# EAGLE board Primary (EAGLE 5.12)
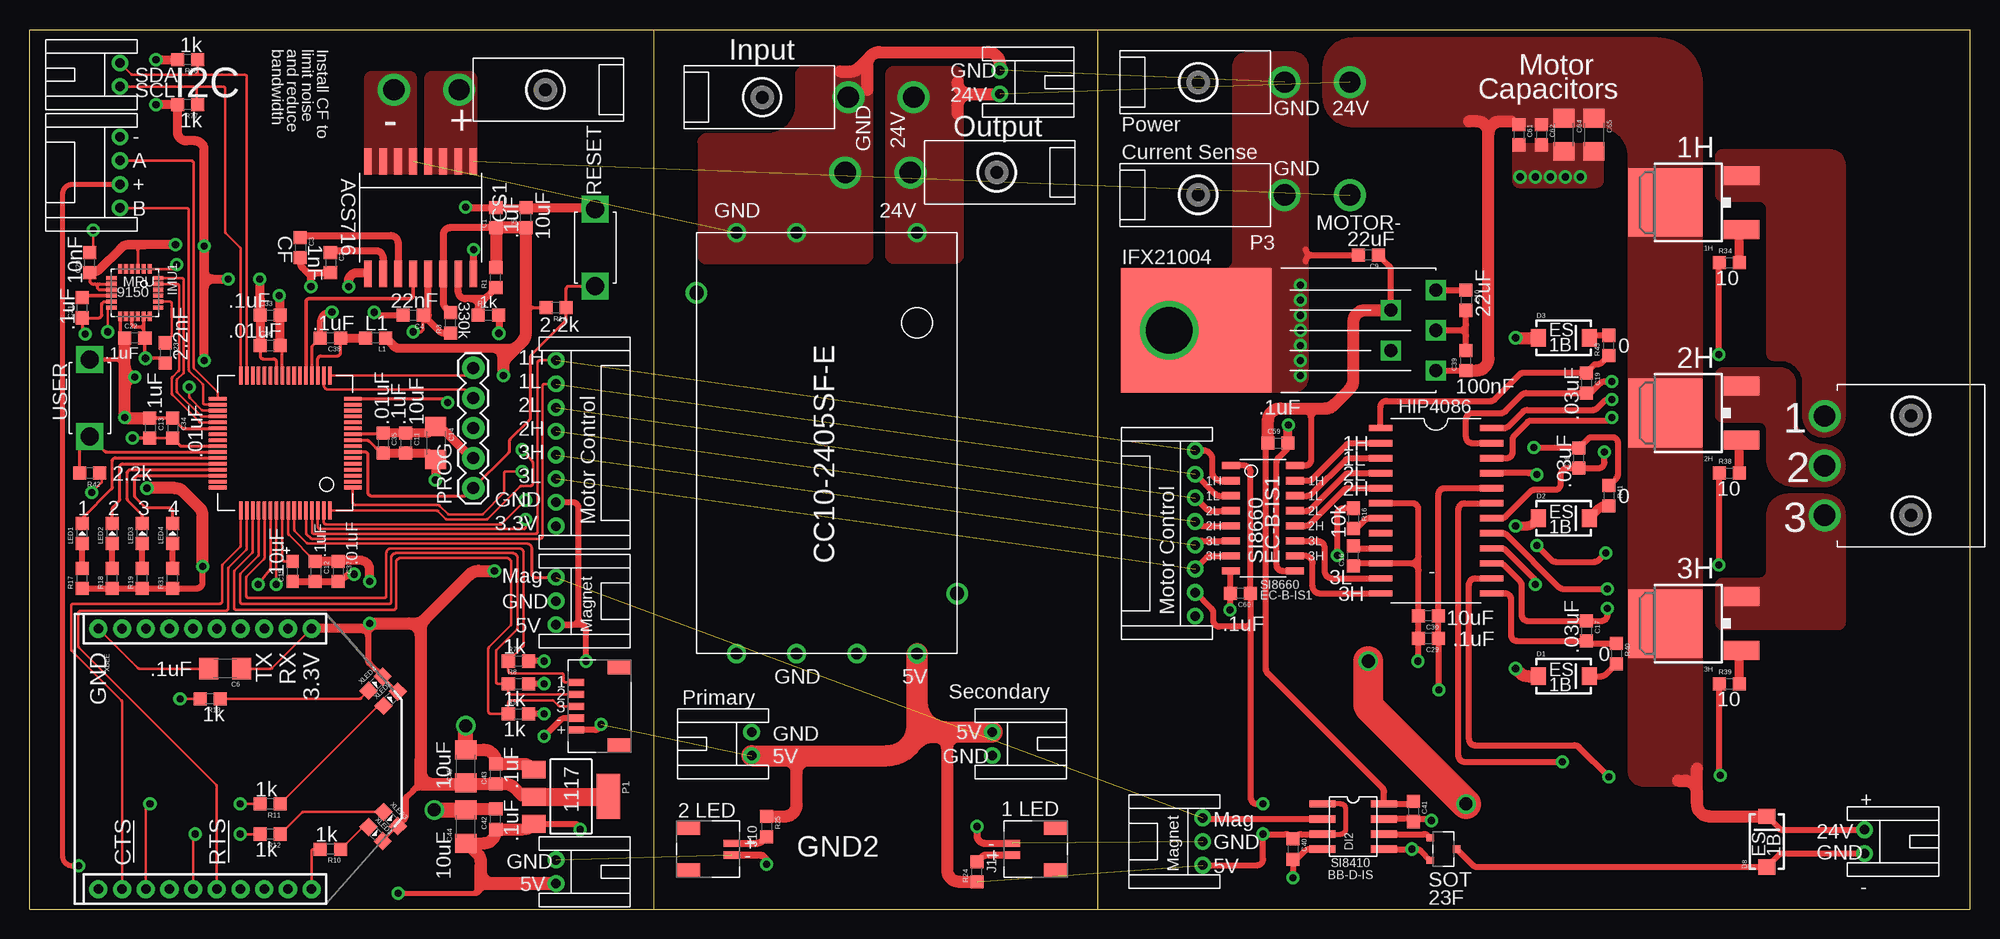
[diagram p4: board, top side]
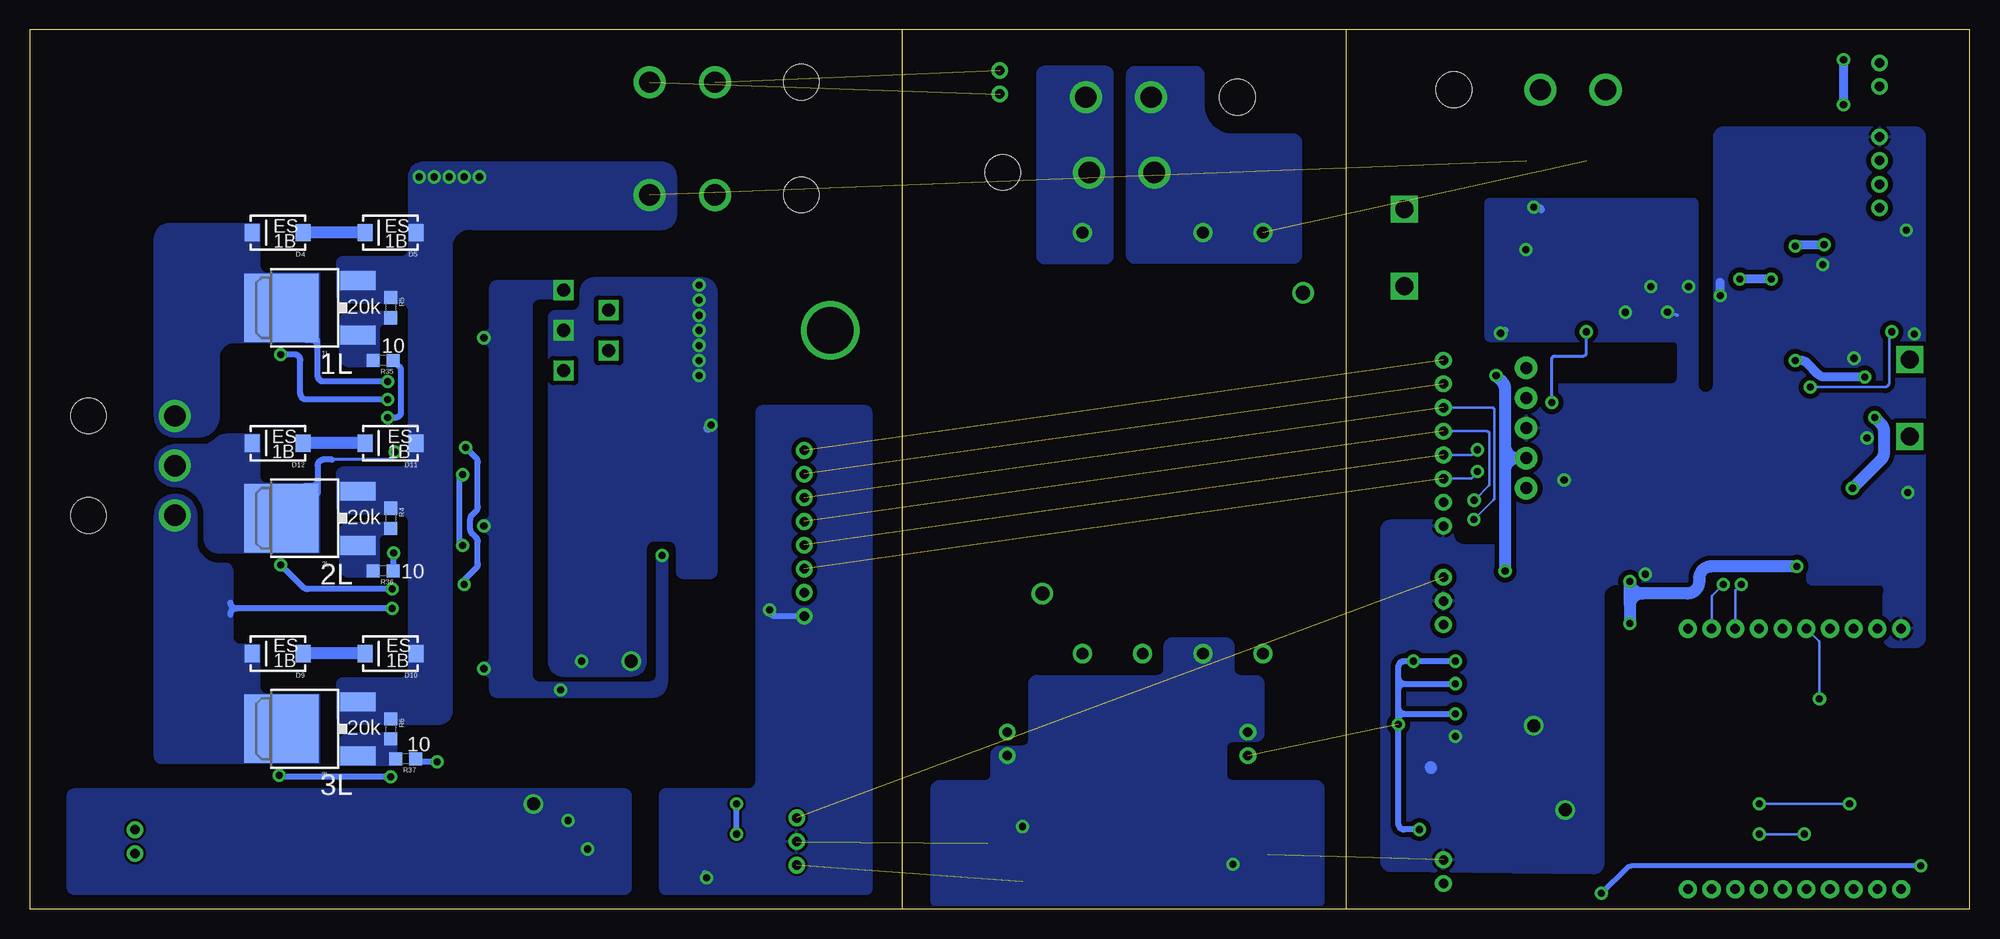
[diagram p5: board, bottom side, seen from below]

Size 163.83 x 74.3 mm. Coordinates in mm from the lower left corner, seen from the top.
Outline: 90.17,0 0,0 0,74.3 52.7,74.3
Outline: 90.17,0 163.83,0 163.83,74.3 90.17,74.3
Outline: 52.7,74.3 90.17,74.3
Outline: 90.17,74.3 90.17,0
Outline: 52.7,74.3 52.7,0
Copper layers (1*4*8*16): Top 0.035mm / dielectric 0.15mm / M-Top 0.035mm / dielectric 0.15mm / M-Bottom 0.035mm / dielectric 0.15mm / Bottom 0.035mm
Design rules "Andrew *": minimum track width 8mil, minimum drill 20mil, track to track 8mil, track to pad 8mil, pad to pad 2mil, via to via 8mil, smd to smd 8mil, copper to edge 10mil, drill to drill 8mil, minimum pad ring 12mil, minimum via ring 10mil, stop-mask expansion 4mil, vias tented up to drill 25mil, thermal gap 10mil

## Footprints (pad centres in the part's own frame; a part is rotated, then mirrored left to right if it is on the bottom)
DPAK = smd 5.791 x 6.274: D 0,1.587 | smd 1.6 x 3: G -2.286,-4.851; S 2.286,-4.851
0603 = smd 1.1 x 1.1: 1 -0.85,0; 2 0.85,0
1206 = smd 1.6 x 1.8: 1 -1.4,0; 2 1.4,0
0603-POL = smd 1.1 x 1: + 0.85,0; - -0.85,0
SOIC16-W = smd 0.65 x 2.25: 1 -4.445,-4.75; 2 -3.175,-4.75; 3 -1.905,-4.75; 4 -0.635,-4.75; 5 0.635,-4.75; 6 1.905,-4.75; 7 3.175,-4.75; 8 4.445,-4.75; 9 4.445,4.75; 10 3.175,4.75; 11 1.905,4.75; 12 0.635,4.75; 13 -0.635,4.75; 14 -1.905,4.75; 15 -3.175,4.75; 16 -4.445,4.75
SMA-DIODE@1 = smd 1.27 x 1.47: A -2.15,0; C 2.15,0
SOIC16-N = smd 0.6 x 1.55: 1 -4.445,-2.7; 2 -3.175,-2.7; 3 -1.905,-2.7; 4 -0.635,-2.7; 5 0.635,-2.7; 6 1.905,-2.7; 7 3.175,-2.7; 8 4.445,-2.7; 9 4.445,2.7; 10 3.175,2.7; 11 1.905,2.7; 12 0.635,2.7; 13 -0.635,2.7; 14 -1.905,2.7; 15 -3.175,2.7; 16 -4.445,2.7
SOIC8-N = smd 2.2 x 0.6: 1 -2.6,1.905; 2 -2.6,0.635; 3 -2.6,-0.635; 4 -2.6,-1.905; 5 2.6,-1.905; 6 2.6,-0.635; 7 2.6,0.635; 8 2.6,1.905
LGA24_4X4 = smd 0.8 x 0.35: 1 -2,1.25; 2 -2,0.75; 3 -2,0.25; 4 -2,-0.25; 5 -2,-0.75; 6 -2,-1.25; 13 2,-1.25; 14 2,-0.75; 15 2,-0.25; 16 2,0.25; 17 2,0.75; 18 2,1.25 | smd 0.35 x 0.85: 7 -1.25,-1.975; 8 -0.75,-1.975; 9 -0.25,-1.975; 10 0.25,-1.975; 11 0.75,-1.975; 12 1.25,-1.975; 19 1.25,1.975; 20 0.75,1.975; 21 0.25,1.975; 22 -0.25,1.975; 23 -0.75,1.975; 24 -1.25,1.975
JST-2-PH-TH = drill 0.8 round: 1 -1,-6.35; 2 1,-6.35
JST-4-PH-TH = drill 0.8 round: 1 -3,-6.35; 2 -1,-6.35; 3 1,-6.35; 4 3,-6.35
JST-8-PH-TH = drill 0.8 round: 1 -7,-6.35; 2 -5,-6.35; 3 -3,-6.35; 4 -1,-6.35; 5 1,-6.35; 6 3,-6.35; 7 5,-6.35; 8 7,-6.35
JST-3-PH-TH = drill 0.8 round: 1 -2,-6.35; 2 0,-6.35; 3 2,-6.35
JST-SH-5 = smd 0.6 x 1.35: 1 2,4.675; 2 1,4.675; 3 0,4.675; 4 -1,4.675; 5 -2,4.675 | smd 1.2 x 2: P$6 -3.3,1; P$7 3.3,1
JST-SH-2 = smd 0.6 x 1.35: 1 0.5,4.675; 2 -0.5,4.675 | smd 1.2 x 2: P$6 -1.8,1; P$7 1.8,1
MOLEX-2-MINIFITJR-RA = drill 1.803 round: 1 0,13.894; 2 0,19.406 | hole 3: 0,6.604
MOLEX-3-MINIFITJR-RA = drill 1.803 round: 1 4.191,13.538; 2 0,13.538; 3 -4.191,13.538 | hole 3: -4.204,6.248; 4.204,6.248
0603-DIODE = smd 1.1 x 1.1: AN -0.85,0; CAT 0.85,0
SOT23F = smd 0.6 x 0.65: D 0,1.125; G -0.95,-1.125; S 0.95,-1.125
SOIC24-W = smd 0.533 x 1.981: 1 -6.985,-4.686; 2 -5.715,-4.686; 3 -4.445,-4.686; 4 -3.175,-4.686; 5 -1.905,-4.686; 6 -0.635,-4.686; 7 0.635,-4.686; 8 1.905,-4.686; 9 3.175,-4.686; 10 4.445,-4.686; 11 5.715,-4.686; 12 6.985,-4.686; 13 6.985,4.686; 14 5.715,4.686; 15 4.445,4.686; 16 3.175,4.686; 17 1.905,4.686; 18 0.635,4.686; 19 -0.635,4.686; 20 -1.905,4.686; 21 -3.175,4.686; 22 -4.445,4.686; 23 -5.715,4.686; 24 -6.985,4.686
SOT223 = smd 1.499 x 2.007: 1 -2.261,-3.15; 2 0.025,-3.15; 3 2.311,-3.15 | smd 3.81 x 2.007: 4 0,3.15
CC10-2405SF-E = drill 1 round: 1 -17.78,7.62; 2 -17.78,-2.54; 3 -17.78,-7.62; 4 17.78,-7.62; 5 17.78,-2.54; 6 17.78,2.54; 7 17.78,7.62 | drill 1.2 round: P$1 12.7,11; P$2 -12.7,-11
TO220-5 = drill 1.1 square: 1 3.81,-3.404; 2 0,-1.702; 3 3.81,0; 4 0,1.702; 5 3.81,3.404 | smd 12.7 x 10.541: PAD -16.434,0 | drill 3.937 round: PAD2 -18.72,0
TQFP64_10X10 = smd 1.5 x 0.3: 1 -5.7,3.75; 2 -5.7,3.25; 3 -5.7,2.75; 4 -5.7,2.25; 5 -5.7,1.75; 6 -5.7,1.25; 7 -5.7,0.75; 8 -5.7,0.25; 9 -5.7,-0.25; 10 -5.7,-0.75; 11 -5.7,-1.25; 12 -5.7,-1.75; 13 -5.7,-2.25; 14 -5.7,-2.75; 15 -5.7,-3.25; 16 -5.7,-3.75; 33 5.7,-3.75; 34 5.7,-3.25; 35 5.7,-2.75; 36 5.7,-2.25; 37 5.7,-1.75; 38 5.7,-1.25; 39 5.7,-0.75; 40 5.7,-0.25; 41 5.7,0.25; 42 5.7,0.75; 43 5.7,1.25; 44 5.7,1.75; 45 5.7,2.25; 46 5.7,2.75; 47 5.7,3.25; 48 5.7,3.75 | smd 0.3 x 1.5: 17 -3.75,-5.7; 18 -3.25,-5.7; 19 -2.75,-5.7; 20 -2.25,-5.7; 21 -1.75,-5.7; 22 -1.25,-5.7; 23 -0.75,-5.7; 24 -0.25,-5.7; 25 0.25,-5.7; 26 0.75,-5.7; 27 1.25,-5.7; 28 1.75,-5.7; 29 2.25,-5.7; 30 2.75,-5.7; 31 3.25,-5.7; 32 3.75,-5.7; 49 3.75,5.7; 50 3.25,5.7; 51 2.75,5.7; 52 2.25,5.7; 53 1.75,5.7; 54 1.25,5.7; 55 0.75,5.7; 56 0.25,5.7; 57 -0.25,5.7; 58 -0.75,5.7; 59 -1.25,5.7; 60 -1.75,5.7; 61 -2.25,5.7; 62 -2.75,5.7; 63 -3.25,5.7; 64 -3.75,5.7
1X05 = drill 1.016 pad 1.88 round: 1 0,0; 2 2.54,0; 3 5.08,0; 4 7.62,0; 5 10.16,0
TACTILE_SWITCH = drill 1.5 square: 1 -3.25,0; 2 3.25,0
XBEE-SILK = drill 0.8 pad 1.524 round: 1 -11,20; 2 -11,18; 3 -11,16; 4 -11,14; 5 -11,12; 6 -11,10; 7 -11,8; 8 -11,6; 9 -11,4; 10 -11,2; 11 11,2; 12 11,4; 13 11,6; 14 11,8; 15 11,10; 16 11,12; 17 11,14; 18 11,16; 19 11,18; 20 11,20

## Placement (x,y rotation side)
1H  IRLR024  [DPAK]  139.7,59.69 90 top
1L  IRLR024  [DPAK]  140.97,50.8 90 bottom
2H  IRLR024  [DPAK]  139.7,41.91 90 top
2L  IRLR024  [DPAK]  140.97,33.02 90 bottom
3H  IRLR024  [DPAK]  139.7,24.13 90 top
3L  IRLR024  [DPAK]  140.97,15.24 90 bottom
C1  .1uF  [0603]  39.37,58.42 90 top
C2  1nF  [0603]  25.4,54.61 270 top
C3  7nF  [0603]  22.86,55.88 270 top
C4  22nF  [0603]  32.38,50.16 180 top
C5  10uF  [0603]  41.91,58.42 90 top
C6  .1uF  [1206]  16.51,20.32 180 top
C9  22uF  [0603]  113.03,55.24 180 top
C10  22uF 15V  [0603]  121.28,51.44 270 top
C11  .1uF  [0603]  31.75,39.37 270 top
C12  .1uF  [0603]  24.13,28.52 270 top
C13  .1uF  [0603]  10.16,40.64 270 top
C14  10uF  [1206]  34.29,39.37 270 top
C15  10uF  [0603-POL]  22.23,28.52 90 top
C16  DNI  [0603]  111.76,29.84 90 top
C17  .03uF 15V  [0603]  131.44,23.5 270 top
C18  .03uF 15V  [0603]  130.81,38.1 90 top
C19  .03uF 15V  [0603]  131.44,44.45 270 top
C20  10nF  [0603]  5.08,54.61 90 top
C21  .1uF  [0603]  4.45,50.8 90 top
C22  .1uF  [0603]  8.89,48.26 0 top
C23  2.2nF  [0603]  11.43,46.99 270 top
C29  .1uF  [0603]  118.11,22.86 180 top
C30  10uF  [0603]  118.11,24.77 180 top
C33  .1uF  [0603]  20.32,50.16 0 top
C34  .01uF  [0603]  12.06,40.64 270 top
C35  .01uF  [0603]  29.84,39.37 270 top
C36  .01uF  [0603]  20.32,47.62 0 top
C37  .01uF  [0603]  26.04,28.52 270 top
C38  .1uF  [0603]  25.4,48.26 180 top
C39  .1uF 48V  [0603]  121.28,46.35 90 top
C40  .1uF  [0603]  106.68,5.08 270 top
C41  .1uF  [0603]  116.84,8.26 270 top
C42  .1uF  [0603]  39.37,7.62 90 top
C43  .1uF  [0603]  39.37,11.43 90 top
C44  10uF  [1206]  36.83,6.99 90 top
C45  10uF  [1206]  36.83,12.06 90 top
C59  .1uF  [0603]  105.41,39.37 0 top
C60  .1uF  [0603]  102.23,26.67 180 top
C61  .01uF  [0603]  125.73,65.41 270 top
C62  .1uF  [0603]  127.64,65.41 270 top
C64  1uF  [1206]  129.54,65.41 270 top
C65  10uF  [1206]  132.08,65.41 270 top
CS1  ACS716KLATR-6BB-T  [SOIC16-W]  33.02,58.42 180 top
D1  ES1B  [SMA-DIODE@1]  129.54,19.68 0 top
D2  ES1B  [SMA-DIODE@1]  129.54,33.02 0 top
D3  ES1B  [SMA-DIODE@1]  129.54,48.26 0 top
D4  ES1B  [SMA-DIODE@1]  142.88,57.15 180 bottom
D5  ES1B  [SMA-DIODE@1]  133.35,57.15 180 bottom
D8  ES1B  [SMA-DIODE@1]  146.69,5.71 90 top
D9  ES1B  [SMA-DIODE@1]  142.88,21.59 180 bottom
D10  ES1B  [SMA-DIODE@1]  133.35,21.59 180 bottom
D11  ES1B  [SMA-DIODE@1]  133.35,39.37 180 bottom
D12  ES1B  [SMA-DIODE@1]  142.88,39.37 180 bottom
DI1  DIGITAL-ISOLATOR-6CH  [SOIC16-N]  104.14,33.02 270 top
DI2  DIGITAL-ISOLATOR-1CHSOIC8-N  [SOIC8-N]  111.76,6.99 0 top
IMU1  MPU-9150  [LGA24_4X4]  8.89,52.07 270 top
J1  [JST-2-PH-TH]  1.27,70.48 90 top
J2  [JST-4-PH-TH]  1.27,62.23 90 top
J3  MO8JST-SH-TH  [JST-8-PH-TH]  50.8,39.37 270 top
J4  [JST-3-PH-TH]  50.8,26.04 270 top
J5  [JST-SH-5]  50.8,17.14 90 top
J6  [JST-2-PH-TH]  50.8,3.17 270 top
J7  [JST-2-PH-TH]  88.27,69.85 270 top
J8  [JST-2-PH-TH]  54.61,13.97 90 top
J9  [JST-2-PH-TH]  87.63,13.97 270 top
J10  [JST-SH-2]  54.61,5.08 270 top
J11  [JST-SH-2]  87.63,5.08 90 top
J12  MO8JST-SH-TH  [JST-8-PH-TH]  92.08,31.75 90 top
J13  [JST-3-PH-TH]  92.71,5.71 90 top
J14  [JST-2-PH-TH]  161.29,5.71 270 top
JP1  [MOLEX-2-MINIFITJR-RA]  50.16,69.22 90 top
JP2  [MOLEX-2-MINIFITJR-RA]  55.24,68.58 270 top
JP3  [MOLEX-2-MINIFITJR-RA]  88.27,62.23 90 top
JP4  [MOLEX-2-MINIFITJR-RA]  92.08,69.85 270 top
JP5  [MOLEX-2-MINIFITJR-RA]  92.08,60.33 270 top
JP6  [MOLEX-3-MINIFITJR-RA]  165.1,37.47 90 top
L1  0ohm  [0603]  29.21,48.26 180 top
LED1  [0603-DIODE]  4.45,31.75 90 top
LED2  [0603-DIODE]  6.99,31.75 90 top
LED3  [0603-DIODE]  9.53,31.75 90 top
LED4  [0603-DIODE]  12.06,31.75 90 top
M1  N-MOSSOT23F  [SOT23F]  119.38,5.08 270 top
MD1  HIP4086  [SOIC24-W]  118.75,33.66 270 top
P1  LINEAR-REGREG1117  [SOT223]  45.72,9.53 270 top
P2  CC10-2405SF-E  [CC10-2405SF-E]  67.31,39.37 270 top
P3  IFX21004TNV51  [TO220-5]  114.94,48.9 0 top
PIC1  DSPIC33EP512MC806  [TQFP64_10X10]  21.59,39.37 180 top
PROG  [1X05]  37.47,35.56 90 top
R1  2k  [0603]  39.37,53.34 90 top
R2  1k  [0603]  38.73,50.16 0 top
R3  330k  [0603]  35.56,49.53 90 top
R4  20k  [0603]  133.35,33.02 270 bottom
R5  20k  [0603]  133.35,50.8 270 bottom
R6  20k  [0603]  133.35,15.24 270 bottom
R7  1k  [0603]  41.27,20.95 0 top
R8  1k  [0603]  41.27,19.05 0 top
R9  1k  [0603]  41.27,16.51 0 top
R10  1k  [0603]  25.4,5.08 180 top
R11  1k  [0603]  20.32,8.89 180 top
R12  1k  [0603]  20.32,6.35 180 top
R13  1k  [0603]  15.24,17.78 180 top
R14  2.2k  [0603]  44.45,50.8 180 top
R16  10k  [0603]  111.76,33.02 270 top
R17  1k  [0603]  4.45,27.94 90 top
R18  1k  [0603]  6.99,27.94 90 top
R19  1k  [0603]  9.53,27.94 90 top
R24  47  [0603]  80.01,3.17 90 top
R25  22  [0603]  62.23,6.99 270 top
R31  1k  [0603]  12.06,27.94 90 top
R34  10ohm  [0603]  143.51,54.61 0 top
R35  10ohm  [0603]  133.99,46.35 180 bottom
R36  10ohm  [0603]  133.99,28.57 180 bottom
R37  10ohm  [0603]  132.08,12.7 180 bottom
R38  10ohm  [0603]  143.51,36.83 0 top
R39  10ohm  [0603]  143.51,19.05 0 top
R40  0ohm  [0603]  133.99,21.59 270 top
R41  0ohm  [0603]  133.35,34.92 270 top
R42  2.2k  [0603]  5.08,36.83 180 top
R43  0ohm  [0603]  133.35,47.62 90 top
R77  1k  [0603]  13.34,67.94 180 top
R78  1k  [0603]  13.34,71.75 180 top
RESET1  TACTILE_SWITCH  [TACTILE_SWITCH]  47.75,55.88 90 top
USER1  TACTILE_SWITCH  [TACTILE_SWITCH]  5.08,43.18 270 top
XBEE  XBEE-1B2  [XBEE-SILK]  3.81,12.7 270 top
XLED1  [0603-DIODE]  29.21,6.35 315 top
XLED2  [0603-DIODE]  30.48,17.78 45 top
XLED3  [0603-DIODE]  30.48,7.62 315 top
XLED4  [0603-DIODE]  29.21,19.05 45 top

## Tracks (layer width: path | path; a pad name or v marks a point on that pad's centre or on a via)
1HO
  Top 0.203: 1H.G 144.36,57.4
  Top 0.762: R34.2 144.36,57.21 1H.G
1HS  (via drill 0.6)
  Top 0.508: v133.6,44.58 132.99,44.58 arc45 132.63,44.43 131.95,43.75 arc-45 131.59,43.6 C19.2 126.36,43.6 arc45 126,43.45 124.61,42.06 arc-45 124.25,41.91 121.79,41.91 arc90 121.28,41.4 121.28,39.88 arc90 121.79,39.37 MD1.23
  Bottom 0.508: v133.6,44.58 139,44.58 arc90 139.51,45.09 139.51,47.56 | 139.51,47.56 arc-90 140.02,48.07 | 140.4,48.07 139.51,48.07 139.51,47.56
  pour Bottom (no thermals): 147.83,41.66 153.29,41.66 153.29,56.64 arc90 152.02,57.91 146.81,57.91 146.56,47.88 arc-90 147.83,46.61
  pour Bottom (no thermals): 151.51,43.43 arc-90 153.29,41.66 arc-90 151.51,39.88 arc-90 149.73,41.66 arc-90
  pour Bottom (no thermals): 139.32,53.72 139.32,47.88 150.75,47.88 150.75,57.91 144.4,57.91 144.4,54.36 arc-90 143.76,53.72
  pour Bottom (no thermals): 147.83,41.66 arc90 149.61,39.88 151.51,39.88 151.51,41.66
  pour Top (no thermals): 151.51,43.43 arc-90 153.29,41.66 arc-90 151.51,39.88 arc-90 149.73,41.66 arc-90
  pour Top (no thermals): 149.73,41.66 153.29,41.66 153.29,62.87 arc90 152.02,64.14 149.73,64.14
  pour Top (no thermals): 142.37,63.5 142.37,60.45 arc90 143,59.82 146.05,59.82 arc-90 146.69,59.18 146.69,46.99 arc90 147.32,46.35 147.83,46.35 arc-90 149.73,44.45 150.11,44.45 150.11,59.82 arc90 150.75,60.45 150.75,64.14 143,64.14 arc90
1LO
  Bottom 0.203: 1L.G 135.47,48.51
  pour Bottom (no thermals): 132.87,50.42 136.8,50.42 arc-90 137.62,49.63 137.62,46.69 arc-90 136.8,45.87 134.37,45.87 134.37,48.97 arc90 133.86,49.48 132.87,49.48
2HO
  Top 0.762: R38.2 144.36,39.43 2H.G
2HS  (via drill 0.6)
  Top 0.508: MD1.18 124.25,33.02 arc45 124.61,33.17 126.72,35.28 arc-45 127.08,35.43 128.78,35.43 arc90 129.29,35.94 129.29,36.74 arc-90 129.79,37.25 C18.1 132.46,37.25 arc90 132.97,37.76 v132.97,38.61
  Bottom 0.254: 132.97,38.48 arc90 133.48,37.97 138.3,37.97
  Bottom 0.508: 139.51,36.26 arc90 140.02,35.75 140.53,35.75 | v132.97,38.61 132.97,38.48 | 138.3,37.97 139,37.97 arc-90 139.51,37.47 139.51,35.12
  pour Top (no thermals): 151.51,39.24 arc-90 153.29,37.47 arc-90 151.51,35.69 arc-90 149.73,37.47 arc-90
  pour Bottom (no thermals): 151.51,39.24 arc-90 153.29,37.47 arc-90 151.51,35.69 arc-90 149.73,37.47 arc-90
  pour Bottom (no thermals): 146.05,40.13 147.09,40.13 arc-45 148.17,39.69 arc45 149.25,39.24 151.51,39.24 151.51,35.69 arc90 149.1,33.27 149.1,31.37 arc-90 147.83,30.1 146.05,30.1
  pour Bottom (no thermals): 139.32,35.94 139.32,30.1 146.56,30.1 146.56,40.13 144.4,40.13 144.4,36.58 arc-90 143.76,35.94
  pour Top (no thermals): 142.37,45.09 142.37,41.78 arc90 143,41.15 146.69,41.15 146.43,45.72 143,45.72 arc90
  pour Top (no thermals): 145.16,45.72 147.83,45.72 arc-90 149.1,44.45 149.1,41.66 arc90 151.51,39.24 151.51,35.69 149.1,35.69 arc-90 146.69,38.1 146.69,40.51 arc90 146.05,41.15 145.16,41.15
2LO
  pour Bottom (no thermals): 132.87,32.64 136.8,32.64 arc-90 137.62,31.85 137.62,28.91 arc-90 136.8,28.09 134.37,28.09 134.37,31.19 arc90 133.86,31.7 132.87,31.7
3.3V  (via drill 0.6)
  Top 0.203: C6.1 20.35,20.32 arc45 20.49,20.38 XBEE.1 | XLED3.CAT XLED1.CAT | 31.02,18.44 XLED2.CAT | 31.02,18.44 arc-45 31.08,18.3 | XLED4.CAT 31.02,18.44 | PIC1.57 21.84,31.75 arc45 21.9,31.61 C12.1
  Top 0.254: 5.46,53.47 5.33,53.47 arc-90 5.08,53.72 | 9.14,55.63 arc90 8.89,55.88 8.19,55.88 arc-90 7.94,56.13 | 9.14,55.63 IMU1.3 | 9.14,55.63 arc-90 9.39,55.88 9.78,55.88 | 42.55,50.8 arc-90 42.29,51.05 | 42.55,50.8 R14.2 | 42.55,50.8 arc90 42.29,50.55 42.29,48.94 arc-90 42.04,48.68 41.91,48.68 | PIC1.38 13.04,40.62 arc-45 12.86,40.69 C34.1 | C20.1 5.08,53.07 arc90 5.33,52.82 5.96,52.82 | PIC1.26 20.84,46.23 arc90 20.59,46.48 19.72,46.48 arc-90 19.47,46.74 C36.1 | PIC1.10 29.75,40.12 arc90 C35.1 | IMU1.9 5.97,52.32 arc-90 5.71,52.57 | 5.71,52.57 5.71,52.82 | 5.96,52.82 IMU1.8 | 5.96,52.82 arc90 5.71,52.57 | 5.71,52.57 arc90 5.47,52.82
  Top 0.279: 7.94,56.13 arc90 7.68,55.88 7.68,55.82
  Top 0.305: 8.1,48.24 C22.1 7.73,48.57 arc-45 7.64,48.79 IMU1.13 | C13.1 C34.1
  Top 0.381: 7.37,46.43 arc-90 7.75,45.92 7.75,45.47 | 7.37,46.43 USER1.1 | 7.37,46.43 arc90 7.75,46.94 7.75,47.24 arc90 8.04,47.54 C22.1
  Top 0.508: R17.1 R18.1 R19.1 R31.1 14.1,27.09 arc90 14.61,27.6 v14.61,28.96 | XLED3.CAT 31.6,7.54 arc45 31.75,7.9 31.75,9.19 arc-45 31.87,9.52 32.37,10.02 arc-45 33.09,10.31 | 32.62,10.27 arc45 32.77,10.62 32.77,12.7 | 32.62,10.27 32.87,10.52 arc45 33.02,10.88 33.02,11.6 | 32.62,10.27 32.53,10.18 arc-45 32.91,10.32 33.05,10.32 arc-45 33.09,10.31 | XLED4.CAT 28.72,20.74 arc-45 28.57,21.1 28.57,23.06 | 28.07,23.57 arc-90 28.57,23.06 | 28.07,23.57 26.67,23.57 | 28.07,23.57 arc90 27.94,23.7 28.07,23.7 | 28.57,23.06 28.57,23.11 arc-90 29.34,23.88 | 28.07,23.57 28.4,23.57 | 41.61,47.96 arc-90 41.24,47.59 41.05,47.59 | 39.88,45.47 39.88,45.21 arc90 v40.01,45.09 | 33.09,10.31 36.58,10.31
  Top 0.61: R3.2 35.1,50.84 arc-45 34.92,51.27 CS1.14 34.92,56.96 arc-90 35.53,57.57 C1.1
  Top 0.762: v14.73,56.01 14.73,53.98 arc90 15.49,53.21 | 15.49,53.21 v16.76,53.21 | 15.49,53.21 arc90 14.73,52.45 | v19.43,53.21 arc-90 19.43,53.09 C33.1 C36.1 | v14.73,46.35 v14.73,56.01 | C35.1 C11.1 33.53,40.22 arc45 33.89,40.37 | 33.89,40.37 C14.1 | PROG.2 arc-45 37.25,38.19 34.92,40.51 arc-45 34.58,40.37 33.89,40.37 | L1.1 30.73,47.59 arc45 31.27,47.37 40.52,47.37 arc45 41.05,47.59 | 39.12,47.37 arc-90 39.88,46.61 39.88,45.47 | XBEE.1 28.07,23.7 arc90 28.57,24.08 v28.7,24.13 | v12.32,56.13 8.32,56.13 arc45 7.78,55.91 7.68,55.82 5.94,54.07 arc-45 5.4,53.85 5.08,53.85 C20.1 5.08,53.72 | v14.73,56.01 14.73,64.14 arc90 13.97,64.9 13.25,64.9 arc-90 12.48,65.66 R77.2 v10.67,67.94 | v10.67,71.75 R78.2 | C12.1 C37.1 26.33,29.37 arc90 26.42,29.46 27.94,29.46 arc-90 28.7,28.7 v28.7,27.69
  Top 1.016: 33.02,23.11 33.02,11.6 arc90 34.04,10.58 36.62,10.58 arc45 C45.1 arc45 37.03,10.58 C43.1 40.18,10.58 arc-45 40.9,10.28 41.38,9.8 arc45 42.1,9.5 P1.2 | 33.02,23.11 arc90 32,24.13 | v9.91,35.56 12.28,35.56 arc-45 13,35.26 14.31,33.95 arc-45 14.61,33.23 v14.61,28.96 | C13.1 8.04,41.49 v8.04,41.53 8.04,45.81 | 8.04,44.11 arc-90 v8.89,44.96 arc-90 8.04,45.81 | 8.04,45.81 C22.1 | 33.02,23.11 33.02,23.71 arc-45 33.32,24.43 | R1.2 C1.1 C5.1 41.91,48.68 arc-45 41.61,47.96 40.3,46.65 arc45 40.01,45.93 v40.01,45.09 | v39.24,28.57 37.89,28.57 arc45 37.17,28.28 33.32,24.43 | v28.7,24.13 32.6,24.13 arc45 33.32,24.43
  Top 1.499: P1.2 48.81,9.5 arc45 P1.4
  Bottom 0.762: v8.89,44.96 12.26,44.96 arc45 12.8,45.18 13.75,46.13 arc-45 14.29,46.35 v14.73,46.35 | v14.73,56.01 arc45 14.43,56.13 v12.32,56.13 | v16.76,53.21 v19.43,53.21 | v10.67,67.94 v10.67,71.75
  Bottom 1.016: 27.69,26.67 arc-90 28.7,25.65 | v9.91,35.56 7.54,37.93 arc-45 7.24,38.65 7.24,40.31 arc-45 7.54,41.03 v8.04,41.53 | 38.23,38.1 arc90 39.24,39.12 | 38.23,38.1 PROG.2 | 39.24,37.08 arc90 38.23,38.1 | v39.24,28.57 39.24,37.08 | 39.24,37.08 39.24,43.9 arc-45 39.54,44.62 v40.01,45.09 | v28.7,27.69 arc90 28.7,27.56 | 28.7,25.65 28.7,27.56 | 28.7,25.65 v28.7,24.13 | 27.69,26.67 arc90 v28.7,27.69 | v28.7,27.69 28.7,27.56 | 27.69,26.67 23.88,26.67 arc-90 22.86,27.69 22.86,27.94 arc90 21.84,28.96 v14.61,28.96
3HO
  Top 0.762: R39.2 144.36,21.65 3H.G
3HS  (via drill 0.6)
  Top 0.508: MD1.15 124.12,29.21 arc-45 124.48,29.06 125.83,27.71 arc-45 125.98,27.35 125.98,24.85 arc90 126.49,24.34 C17.1 132.72,24.34 arc90 133.22,24.85 v133.22,25.4
  Bottom 0.508: 146.37,25.4 arc90 146.88,25.91 | v133.22,25.4 146.37,25.4 | 146.37,25.4 arc-90 146.88,24.89
  pour Bottom (no thermals): 149.73,33.27 153.29,33.27 153.29,12.95 arc-90 152.65,12.32 147.07,12.32 arc-90 146.43,12.95 146.43,22.35 148.46,22.35 arc90 149.73,23.62
  pour Bottom (no thermals): 139.32,18.16 139.32,12.32 150.75,12.32 150.75,22.35 144.4,22.35 144.4,18.8 arc-90 143.76,18.16
  pour Bottom (no thermals): 151.51,35.05 arc-90 153.29,33.27 arc-90 151.51,31.5 arc-90 149.73,33.27 arc-90
  pour Top (no thermals): 151.51,35.05 arc-90 153.29,33.27 arc-90 151.51,31.5 arc-90 149.73,33.27 arc-90
  pour Top (no thermals): 142.37,27.3 142.37,24.26 arc90 143,23.62 152.65,23.62 arc90 153.29,24.26 153.29,33.27 149.73,33.27 149.73,29.21 arc-90 148.46,27.94 143,27.94 arc90
  pour Top (no thermals): 144.65,27.94 146.05,27.94 arc90 146.69,28.57 146.69,33.27 arc-90 148.46,35.05 151.51,35.05 151.51,27.56 144.65,27.56
  pour Bottom (no thermals): 149.73,32.38 149.73,31.11 arc-90 147.83,29.21 147.32,29.21 arc90 146.69,28.57 146.69,22.99 arc-90 146.05,22.35 144.91,22.35 144.91,21.59 151.89,21.59 151.89,32.38
3LO
  pour Bottom (no thermals): 132.87,14.86 136.8,14.86 arc-90 137.62,14.07 137.62,12.19 132.87,12.19
5V1
  Top 0.406: 104.39,39.2 104.56,39.2 C59.1
  Top 0.508: C9.1 114.79,54.34 arc-45 114.94,53.98 P3.4 | DI1.16 107.7,37.47 arc90 108.2,37.97 108.2,41.53 | 108.2,41.53 arc90 107.7,42.04 | 108.2,41.53 arc-90 108.71,42.04 arc-90 108.97,42.29 109.39,42.29 | C41.1 arc-90 116.62,8.89 DI2.8 114.36,9.89 arc45 114.21,10.25 104.54,19.92 arc-45 104.39,20.28 104.39,39.2
  Top 1.016: P3.4 112.78,50.6 arc90 111.76,49.58 111.76,44.66 arc-45 111.46,43.94 110.11,42.59 arc-45 109.39,42.29 105.58,42.29 arc90 104.56,41.27 C59.1
5V2  (via drill 0.6)  (2 unrouted)
  Top 0.203: 38.1,3.81 arc45 38.05,3.94 | 38.1,3.81 | 38.1,3.96 38.1,3.81
  Top 0.406: v4.14,3.66 3.61,3.66 arc-90 2.79,4.47 2.79,60.42 arc-90 3.61,61.23 J2.2 | 38.1,3.96 arc90 37.8,3.66 37.8,1.97 | 37.9,4 arc-45 38.05,3.94 38.1,3.89 | 37.39,1.33 arc90 37.8,1.74 37.8,1.97 | 37.39,1.33 37.61,1.33 arc45 37.9,1.45 38.18,1.74 arc-45 38.47,1.85 44.42,1.85 | 37.8,1.97 38.12,1.97 | v31.13,1.33 37.39,1.33 | 106.41,6.2 106.68,6.2 C40.1 | DI2.3 110.72,6.35 arc90 111.12,6.76 111.12,8.48 arc90 110.72,8.89 DI2.1
  Top 0.508: P1.3 46,7.21 arc-90 v46.48,6.73 | v48.26,15.62 arc-90 47.78,15.14 J5.5 | v43.43,20.95 R7.2 | v43.43,19.05 R8.2 | v43.43,16.51 R9.2 | v46.99,20.95 46.99,23.53 arc90 46.48,24.04 J4.3 45.85,24.04 arc90 46.35,24.54 46.35,24.59 | 46.35,24.59 arc45 46.5,24.23 46.86,23.88 | DI1.1 102.58,37.47 arc-90 103.08,36.96 C60.1 arc-90 103.12,26.63 103.12,24.38 | J12.2 99.8,25.38 arc-45 99.95,25.02 99.95,24.38 arc90 100.46,23.88 102.62,23.88 | 106.41,6.2 arc45 106.05,6.35 v104.14,6.35 104.14,4.22 arc-90 103.63,3.71 J13.1 | 44.42,1.85 44.43,1.86 arc45 44.45,1.91 J6.2 | 103.12,24.38 arc-90 102.62,23.88 | 103.12,23.37 103.12,24.38 | v104.14,8.89 103.63,8.89 arc-90 103.12,9.4 103.12,23.37 | 103.12,23.37 arc90 102.62,23.88 | DI2.3 107.36,6.35 arc45 106.91,6.16 C40.1 106.61,5.86 | 46.35,24.59 46.35,33.86 arc90 45.85,34.37 J3.7
  Top 1.016: J6.2 39.12,2.17 arc-90 38.1,3.19 | 38.1,2.54 38.1,3.81 38.1,3.96 38.1,4 arc45 37.8,4.72 37.01,5.51 arc45 C44.1 38.35,5.58 arc90 39.37,6.6 C42.1 41.71,6.77 arc45 42.42,7.07 P1.3 | R25.1 63.75,7.83 arc90 64.77,8.85 64.77,11.58 | 64.77,11.58 arc90 63.75,12.6 61.33,12.6 arc-90 J8.1 | 64.77,11.58 arc-90 65.79,12.6 | R24.1 78.49,2.33 arc-90 77.47,3.34 77.47,13.56 | 77.47,13.56 arc90 76.45,14.58 76.2,14.58 | 76.2,14.58 75.77,14.58 | 78.49,14.61 arc90 77.47,13.59 77.47,13.56 | 76.45,14.97 76.45,14.83 arc-90 76.2,14.58
  Top 1.778: J8.1 72.39,12.97 arc90 74.93,15.51 P2.7 74.93,17.51 arc90 77.47,14.97 | 77.47,14.97 J9.1 | 74.45,14.02 74.65,14.23 arc-45 76.45,14.97 77.47,14.97
  Bottom 0.203: v43.43,20.95 43.56,21.08 | v43.43,19.05 43.56,19.05 | v43.43,16.51 43.43,16.64
  Bottom 0.406: v4.14,3.66 28.55,3.66 arc-45 28.98,3.48 v31.13,1.33
  Bottom 0.508: v46.48,6.73 47.75,6.73 arc90 48.26,7.24 v48.26,15.62 | 47.75,16.51 arc-90 48.26,16 v48.26,15.62 | 48.26,18.54 48.26,19.56 | 48.26,18.54 arc90 47.75,19.05 | v48.26,15.62 48.26,17.02 | 47.75,16.51 v43.43,16.51 | 48.26,17.02 arc-90 47.75,16.51 | 48.26,17.02 48.26,18.54 | 47.75,19.05 v43.43,19.05 | 48.26,19.56 arc-90 47.75,19.05 | 48.26,19.56 48.26,20.45 arc90 47.75,20.95 v46.99,20.95 v43.43,20.95 | v104.14,6.35 v104.14,8.89
15V  (via drill 0.6)
  Top 0.254: 119,22.86 C29.1
  Top 0.508: v119,18.54 119,22.86 | C29.1 C30.1 118.96,35.05 arc-90 119.47,35.56 MD1.20 | R16.1 110.92,33.87 arc90 110.41,33.36 v110.41,29.87 | C10.1 arc90 C10.1 P3.5
  Top 0.762: v125.48,32.38 126.49,32.38 arc45 126.94,32.57 D2.A
  Top 1.016: v125.48,48.26 D3.A | D1.A 126.53,19.68 arc-45 125.81,19.98 v125.48,20.32
  pour Bottom (isolate 0.254, no thermals): 117.98,53.09 124.33,53.09 arc-90 124.97,52.45 124.97,33.4 arc90 125.48,32.89 arc-90 125.98,32.38 arc-90 125.48,31.88 arc90 124.97,31.37 124.97,18.54 arc-90 124.33,17.91 111.25,17.91 arc-90 109.98,19.18 109.98,29.84 arc-90 110.36,30.35 arc-90 110.87,29.84 110.87,19.81 arc90 111.51,19.18 120.78,19.18 arc90 121.41,19.81 121.41,50.93 arc90 120.78,51.56 117.98,51.56
  pour Bottom: 124.97,21.84 124.97,21.34 arc90 125.48,20.83 arc-90 125.98,20.32 arc-90 125.48,19.81 arc90 124.97,19.3 124.97,19.05 124.84,19.05 arc-90 124.71,19.18 124.71,21.84
  pour Bottom: 124.97,33.91 124.97,33.4 arc90 125.48,32.89 arc-90 125.98,32.38 arc-90 125.48,31.88 arc90 124.97,31.37 124.97,30.48 124.84,30.48 arc-90 124.71,30.61 124.71,33.91
  pour Bottom: 124.97,49.78 124.97,49.28 arc90 125.48,48.77 arc-90 125.98,48.26 arc-90 125.48,47.75 arc90 124.97,47.24 124.97,46.35 124.84,46.35 arc-90 124.71,46.48 124.71,49.78
24V  (1 unrouted)
  Top 0.508: P3.1 arc-90 118.76,45.51 C39.1 | D8.C 147.76,6.79 arc45 147.94,6.71 J14.1
  Top 1.016: C39.1 122.17,45.51 arc90 123.19,46.52 123.19,65.53 | 123.19,65.53 arc-90 124.21,66.55 125.09,66.55 | 123.19,65.53 arc90 122.17,66.55 121.54,66.55 | D8.C 141.8,7.87 arc-90 140.78,8.88 140.78,9.84 arc90 139.76,10.86 139.19,10.86 | 140.78,8.95 140.78,11.87 | 79.38,68.85 arc-90 78.36,69.87 | 79.38,68.85 J7.2 | 79.38,68.85 arc90 78.36,67.83 78.36,67.18
  pour Top (no thermals): 140.59,66.67 arc-90 141.22,66.04 141.22,10.41 136.27,10.41 arc-90 135,11.68 135,66.04 arc-90 135.64,66.67
  pour Top (no thermals): 111.76,73.6 137.41,73.6 arc-90 141.22,69.79 141.22,63.56 135,63.56 arc90 132.46,66.1 111.76,66.1 arc-90 109.22,68.64 109.22,71.06 arc-90
  pour Bottom (no thermals): 72.39,55.24 72.39,70.48 arc-90 73.03,71.12 78.11,71.12 arc-90 78.74,70.48 78.74,55.24 arc-90 78.11,54.61 73.03,54.61 arc-90
  pour Top (no thermals): 72.39,55.24 72.39,70.48 arc-90 73.03,71.12 78.11,71.12 arc-90 78.74,70.48 78.74,55.24 arc-90 78.11,54.61 73.03,54.61 arc-90
CTS
  Top 0.203: PIC1.49 arc-90 PIC1.49 17.84,30.75 arc-45 17.78,30.61 16.32,29.14 arc45 16.26,29 16.26,26.01 arc-90 16.05,25.81 3.71,25.81 arc90 3.5,25.6 3.5,21.98 arc45 3.56,21.84 7.75,17.65 arc-45 7.81,17.51 XBEE.12
FAULT  (via drill 0.6)
  Top 0.254: C4.1 33.23,49.02 arc-90 32.98,48.77 v32.38,48.77 | PIC1.16 34.88,43.12 arc-45 35.06,43.05 v35.31,42.8
  Top 0.61: R3.1 34.97,48.68 arc-45 34.54,48.86 C4.1 33.48,49.77 arc45 33.66,50.2 CS1.13
  Bottom 0.254: v32.38,48.77 32.38,46.99 arc90 32.64,46.74 35.05,46.74 arc-90 35.31,46.48 v35.31,42.8
GND1  (via drill 0.6, 1.1)  (2 unrouted)
  Top 0.508: 108.27,55.24 arc90 107.76,54.74 | 108.27,55.24 C9.2 | 107.76,55.75 arc90 108.27,55.24 | 120.78,48.9 arc-90 121.28,48.39 C39.2 C10.2 | 120.78,48.9 arc90 121.28,49.4 | 120.78,48.9 P3.3 | MD1.6 116.75,34.29 arc-90 117.26,33.78 117.26,29.84 | v117.22,20.95 arc90 117.26,20.99 C29.2 C30.2 117.26,29.84 | C16.1 arc-90 111.97,29.21 MD1.10 116.62,29.21 | 117.26,29.84 arc-90 116.62,29.21 | 116.62,29.21 arc-90 117.26,28.57 | DI1.9 105.79,28.57 arc-90 105.28,29.08 105.28,37.76 arc-45 105.43,38.12 106.11,38.8 arc45 106.26,39.16 | 116.62,7.62 DI2.7 | C41.2 arc90 116.62,7.62 | DI2.5 v116.71,5.08 117.09,5.08 arc-45 117.45,4.93 M1.S | 116.62,7.62 118.06,7.62 arc-45 v118.36,7.49
  Top 0.762: 106.26,39.16 C59.2 106.26,40.6 arc-90 v106.3,40.89
  Top 1.016: J7.1 81.92,71.37 arc90 80.9,72.39 71.75,72.39 arc90 70.74,71.37 70.74,69.22 | 68.45,70.74 69.26,70.74 arc45 69.98,71.04 71.05,72.11
  Top 2.54: v121.28,8.89 113.21,16.97 arc-45 113.03,17.4 v113.03,20.95
  Bottom 0.508: v117.22,20.95 117.09,20.95
  Bottom 0.762: v106.3,40.89 106.55,40.64
  other vias: 107.31,52.7 107.31,51.44 107.31,50.16 107.31,48.9 107.31,46.35 107.31,45.09 107.31,47.62
  pour Top (no thermals): 28.35,62.18 28.35,70.1 arc-90 28.96,70.71 32,70.71 arc-90 32.61,70.1 32.61,62.18
  pour Top (no thermals): 106.68,72.39 arc-90 107.95,71.12 107.95,44.96 arc-90 106.68,43.69 99.69,43.69 arc-90 98.42,44.96 98.42,53.47 arc-90 99.06,54.1 100.97,54.1 arc90 101.6,54.74 101.6,71.12 arc-90 102.87,72.39
  pour Bottom (isolate 0.381, no thermals): 111.76,20.95 111.76,30.48 arc90 111.12,31.11 109.86,31.11 arc90 109.22,30.48 109.22,28.57 arc-90 108.58,27.94 106.43,27.94 arc-90 105.79,28.57 105.79,52.07 arc-90 107.06,53.34 116.08,53.34 arc-90 117.35,52.07 117.35,51.18 arc90 117.98,50.55 119.38,50.55 arc-90 120.02,49.91 120.02,20.95 arc-90 118.75,19.68 113.03,19.68 arc-90
  pour Bottom (no thermals): 113.67,1.27 160.02,1.27 arc90 160.66,1.91 160.66,9.53 arc90 160.02,10.16 113.67,10.16 arc90 113.03,9.53 113.03,1.91 arc90
  pour Bottom (no thermals): 57.15,54.61 70.48,54.61 arc90 71.12,55.24 71.12,70.48 arc90 70.48,71.12 65.41,71.12 arc90 64.77,70.48 64.77,67.94 arc-90 62.23,65.41 57.15,65.41 arc90 56.52,64.77 56.52,55.24 arc90
  pour Top (no thermals): 57.15,54.61 70.48,54.61 arc90 71.12,55.24 71.12,70.48 arc90 70.48,71.12 65.41,71.12 arc90 64.77,70.48 64.77,67.94 arc-90 62.23,65.41 57.15,65.41 arc90 56.52,64.77 56.52,55.24 arc90
GND2  (via drill 0.6, 1.1)  (2 unrouted)
  Top 0.203: CS1.16 arc45 37.49,53.73 | C13.2 C34.2 | R42.1 6.16,36.6 arc-45 6.1,36.45 6.1,36.13 arc-45 6.04,35.99 v5.26,35.2 | 5.08,55.6 C20.2 5.3,55.68 arc45 5.36,55.82 v5.36,57.35 | IMU1.1 12.22,54.07 arc90 12.42,54.27 v12.42,54.46 | C6.2 9.27,20.32 arc-45 9.13,20.38 XBEE.10 | 28.48,53.76 arc-90 CS1.9
  Top 0.254: IMU1.11 6.35,51.32 arc90 6.1,51.07 6.1,50.2 arc-90 5.84,49.95 C21.1 4.45,48.82 arc90 v4.7,48.56 | PIC1.41 12.84,39.12 arc-45 12.66,39.19 C34.2 | PIC1.25 21.34,47.33 | PIC1.9 28.47,39.62 arc-45 28.65,39.55 29.61,38.59 arc45 29.78,38.52 C35.2 | PIC1.20 23.84,47.45 arc-45 23.91,47.62 C38.2
  Top 0.305: IMU1.18 IMU1.17 9.64,49.48 | C13.2 8.87,39.79 arc-90 8.56,39.84 v8.69,39.8 | C23.2 11.1,46.47 arc45 10.95,46.53 v9.78,46.53 arc-90 9.74,46.57 C22.2 9.73,48.27 arc-45 9.64,48.49 9.64,48.87 | 21.34,47.33 arc45 21.25,47.54 C36.2 | 9.64,48.87 9.64,49.48 | IMU1.15 8.64,49.48 arc90 8.95,49.17 9.34,49.17 | 9.64,49.48 arc-90 9.34,49.17 | 9.64,48.87 arc90 9.34,49.17
  Top 0.508: DI1.8 arc90 101.39,28.52 C60.2 101.39,25.31 arc-90 v101.35,25.27 | J5.4 45.18,16.14 arc45 44.83,16 v43.43,14.61 | C38.2 24.55,49.68 arc-90 25.31,50.44 v25.53,50.44 | v29.08,50.42 arc90 29.34,50.16 C4.2 | DI2.4 108.09,5.08 arc45 107.64,4.89 107.16,4.42 arc-45 106.71,4.23 C40.2 v106.68,2.67
  Top 0.61: v27.41,28.3 27.04,28.29 arc-45 27.02,28.31 C37.2 C12.2 C15.- | C5.2 C1.2 36.87,59.27 arc-90 v36.83,59.31 | 37.49,53.73 v37.49,55.73 | R2.2 arc-45 39.62,50.07 v39.62,48.64 | C3.2 22.86,54.61 arc45 23.04,54.18 23.28,53.94 | 23.37,53.85 23.28,53.94 | 23.37,53.85 arc45 23.58,53.76 | 23.75,53.15 arc-90 24.36,53.76 | v23.75,52.58 23.75,53.15 | 23.75,53.15 23.75,53.22 arc45 23.57,53.65 23.37,53.85 | C2.2 23.71,53.76 arc-45 23.28,53.94 | J11.1 80.62,5.58 arc-90 80.01,6.19 v80.01,6.99 | J10.1 61.62,4.58 arc-90 62.23,3.97 v62.23,3.81
  Top 0.762: C36.2 C33.2 21.17,51.73 arc90 v21.08,51.82 | C35.2 C11.2 33.53,38.52 arc-45 33.89,38.37 34.04,38.22 | 34.04,38.22 C14.2 | v34.27,36.25 34.27,37.68 arc45 34.04,38.22 | RESET1.2 arc45 47.41,59.27 C5.2 | 28.48,53.76 27.69,53.76 arc90 26.92,53 v26.92,52.58
  Top 1.016: C45.2 38.35,13.46 arc-90 39.37,12.45 C43.2 41.66,12.28 arc-45 42.37,11.98 P1.1 | C42.2 37.03,8.47 arc45 C44.2
  Top 1.27: C45.2 v36.83,15.49 | v34.16,8.38 C44.2
  Bottom 0.203: v5.26,35.2 arc-45 5.21,35.63 5.13,35.71 | v12.42,54.46 arc90 12.62,54.66
  Bottom 0.305: v9.78,46.53 9.98,46.53 | v8.69,39.8 8.69,39.83 | v25.53,50.44 24.7,50.19 arc-45 24.77,50.16
  Bottom 0.406: v34.27,36.25 34.06,36.17
  Bottom 0.508: v101.35,25.27 101.35,25.26 arc-90 100.84,24.75 J12.1 | v43.43,14.61 arc45 43.34,14.82 43.31,14.86 | v80.01,6.99 arc90 80.09,7.06 80.09,7.16 | v106.68,2.67 106.81,3.05
  Bottom 0.61: v36.83,59.31 36.45,59.31 arc90 36.2,59.05 | v29.08,50.42 arc-45 29.08,50.47 29.08,50.55 | v39.62,48.64 arc-45 39.32,48.9 39.24,48.9 | v62.23,3.81 62.28,3.81 arc-90 62.36,3.73
  Bottom 0.762: v21.08,51.82 21.08,52.96
  Bottom 1.016: 45.54,11.99 45.48,11.93
  pour Bottom (isolate 0.406): 24.23,44.15 23.42,44.15 arc-90 23.01,44.55 23.01,59.59 arc-90 23.42,59.99 40.49,59.99 arc-90 40.89,59.59 40.89,48.41 arc-90 40.49,48.01 25.04,48.01 arc90 24.64,47.6 24.64,44.55 arc-90
  pour Bottom (isolate 0.406): 3.81,65.2 arc-90 4.62,66.01 20.78,66.01 arc-90 21.59,65.2 21.59,44.3 arc180 23.01,44.3 23.01,44.5 arc-90 23.42,44.91 24.64,44.91 arc90 25.25,44.3 38,44.3 arc-90 38.63,43.66 38.61,31.75 arc90 39.62,30.73 42.67,30.73 arc90 43.69,31.75 43.69,31.8 arc-90 44.7,32.82 48.87,32.82 arc-90 49.68,32 49.68,4.06 arc-90 48.87,3.25 31.78,3.05 arc-90 30.96,3.86 30.96,26.62 arc90 29.51,27.43 15.57,27.43 arc-90 15.37,27.64 15.37,29.26 arc90 15.16,29.46 13.92,29.46 arc90 13.72,29.26 13.72,27.89 arc-90 13.26,27.43 7.44,27.43 arc90 7.26,26.62 7.26,22.96 arc-90 6.45,22.15 4.62,22.15 arc-90 3.81,22.96
  pour Bottom (isolate 0.381, no thermals): 101.85,42.55 arc-90 102.49,41.91 102.49,8.89 arc-90 101.85,8.26 93.34,8.26 arc-90 92.71,8.89 92.71,41.91 arc-90 93.34,42.55
  pour Bottom: 93.22,10.16 100.46,10.16 arc90 100.97,10.67 100.97,12.19 arc-90 101.47,12.7 101.98,12.7 arc-90 102.49,12.19 102.49,10.79 arc90 103.12,10.16 104.14,10.16 110.11,10.16 arc-90 110.62,9.65 110.62,1.78 arc-90 110.11,1.27 93.22,1.27 arc-90 92.71,1.78 92.71,9.65 arc-90
  pour Bottom (no thermals): 82.55,13.08 arc90 81.92,13.72 80.01,13.72 arc-90 79.38,14.35 79.38,19.05 arc90 78.74,19.68 68.58,19.68 arc-90 67.94,20.32 67.94,22.23 arc90 67.31,22.86 62.87,22.86 arc90 62.23,22.23 62.23,20.32 arc-90 61.59,19.68 60.33,19.68 arc90 59.69,19.05 59.69,14.86 arc90 60.33,14.22 62.23,14.22 arc-90 62.87,13.59 62.87,11.43 arc-90 62.23,10.79 55.24,10.79 arc90 54.61,10.16 54.61,0.76 arc90 55.24,0.13 87,0.13 arc90 87.63,0.76 87.63,10.16 arc90 87,10.79 83.19,10.79 arc-90 82.55,11.43
HALL1
  Top 0.203: J5.1 45.29,19.14 arc-90 45.09,19.35 45.09,19.74 arc90 44.88,19.94 40.63,19.94 arc-90 40.42,20.14 R7.1 41.67,22.2 arc45 41.73,22.35 41.73,30.07 arc90 41.33,30.48 30.53,30.48 arc90 30.12,30.07 30.12,26.49 arc-90 29.92,26.29 18.49,26.29 arc-90 18.29,26.49 18.29,27.98 arc-45 18.35,28.13 19.78,29.56 arc45 19.84,29.7 PIC1.53
HALL2
  Top 0.203: J5.2 40.63,18.14 arc-90 40.42,18.35 R8.1 39.57,19.05 arc-90 39.37,19.25 39.37,21.76 arc-45 39.43,21.9 41.14,23.61 arc45 41.2,23.76 41.2,29.67 arc90 40.79,30.07 30.94,30.07 arc90 30.53,29.67 30.53,25.98 arc-90 30.33,25.78 17.98,25.78 arc-90 17.78,25.98 17.78,28.24 arc-45 17.84,28.38 19.28,29.82 arc45 19.34,29.96 PIC1.52
HALL3
  Top 0.203: J5.3 44.79,17.14 arc-45 44.65,17.2 44.26,17.59 arc45 44.11,17.65 40.63,17.65 arc90 40.42,17.45 R9.1 38.94,16.51 arc-90 38.73,16.71 38.73,22.01 arc-45 38.79,22.16 40.61,23.97 arc45 40.66,24.11 40.66,29.26 arc90 40.26,29.67 31.34,29.67 arc90 30.94,29.26 30.94,25.48 arc-90 30.73,25.27 17.48,25.27 arc-90 17.27,25.48 17.27,28.49 arc-45 17.33,28.63 18.78,30.08 arc45 18.84,30.23 PIC1.51
I_SENSE
  Top 0.279: PIC1.21 23.34,51.31 arc-90 23.59,51.56 32.13,51.56 arc90 32.38,51.82 CS1.12
IMU_INT1  (via drill 0.6)
  Top 0.203: PIC1.35 14.68,42.12 arc-45 14.54,42.18 13.55,43.17 arc-45 13.49,43.31 v13.49,44.09 | IMU1.12 6.6,50.82 v6.6,48.77
  Bottom 0.203: v13.49,44.09 7.21,44.09 arc-90 6.81,44.5 6.81,48.4 arc45 6.69,48.68 v6.6,48.77
LED1
  Top 0.254: PIC1.43 7.24,38.12 arc90 6.99,37.87 6.99,35.66 arc-45 6.91,35.49 4.52,33.09 arc45 4.45,32.91 LED1.CAT
LED2
  Top 0.254: PIC1.44 7.87,37.62 arc90 7.62,37.37 7.62,34.65 arc-45 7.55,34.47 7.06,33.98 arc45 6.99,33.8 LED2.CAT
LED3
  Top 0.254: PIC1.45 8.51,37.12 arc90 8.26,36.87 8.26,34.65 arc45 8.33,34.47 9.45,33.35 arc-45 9.53,33.17 LED3.CAT
LED4
  Top 0.254: LED4.CAT 12.06,33.66 arc90 11.81,33.91 9.88,33.91 arc-45 9.71,33.98 8.96,34.72 arc-45 8.89,34.9 8.89,36.37 arc-90 9.14,36.62 PIC1.46
MCLR1
  Top 0.254: PIC1.7 28.32,38.62 arc-90 28.57,38.37 28.57,35.18 arc90 28.83,34.92 36.73,34.92 arc45 36.9,35 PROG.1 40.44,38.53 arc45 40.51,38.71 40.51,39.52 arc-45 40.59,39.7 42.22,41.33 arc45 42.29,41.51 42.29,46.63 arc-45 42.37,46.81 45.23,49.67 arc45 45.3,49.85 R14.1 45.3,52.38 arc-90 45.55,52.63 RESET1.1
MOTOR-  (via drill 0.6)  (1 unrouted)
  other vias: 125.86,61.85 127.13,61.85 128.4,61.85 129.67,61.85 130.94,61.85
  pour Top (no thermals): 33.43,62.18 33.43,70.1 arc-90 34.04,70.71 37.08,70.71 arc-90 37.69,70.1 37.69,62.18
  pour Bottom (no thermals): 128.14,17.02 128.14,56.52 131.83,56.52 131.83,17.02
  pour Bottom (no thermals): 131.83,56.26 131.83,55.75 arc90 132.46,55.12 137.29,55.12 arc-90 137.92,54.48 137.92,51.82 arc-90 137.29,51.18 132.46,51.18 arc90 131.83,50.55 131.83,50.42 130.94,50.42 130.94,58.17
  pour Bottom (no thermals): 131.83,38.48 131.83,37.97 arc90 132.46,37.34 137.29,37.34 arc-90 137.92,36.7 137.92,34.04 arc-90 137.29,33.4 132.46,33.4 arc90 131.83,32.77 131.83,32.64 130.94,32.64 130.94,38.48
  pour Bottom (no thermals): 131.83,20.7 131.83,20.19 arc90 132.46,19.56 137.29,19.56 arc-90 137.92,18.92 137.92,16.26 arc-90 137.29,15.62 129.29,15.62 arc-90 128.14,16.76 128.14,20.7
  pour Bottom (no thermals): 109.22,58.67 109.22,61.85 arc-90 110.49,63.12 130.56,63.12 arc-90 131.83,61.85 131.83,56.26 128.14,56.26 arc90 126.36,57.4 110.49,57.4 arc-90
  pour Top (no thermals): 132.84,64.64 125.22,64.64 125.22,61.59 arc90 125.86,60.96 132.21,60.96 arc90 132.84,61.59
N$2
  Top 0.508: MD1.7 113.11,33.02 arc45 112.75,32.87 112.04,32.16 111.79,32.16 arc-45 R16.2
N$3
  Top 0.508: C16.2 arc90 111.97,30.48 MD1.9
N$4  (via drill 0.6)
  Top 0.203: XBEE.13 9.81,8.46 arc-45 9.87,8.6 v10.16,8.89 | v17.78,8.89 R11.2
  Bottom 0.203: v10.16,8.89 v17.78,8.89
N$5
  Top 0.61: CS1.15 36.2,52.17 arc90 36.8,51.56 37.27,51.56 | 37.27,51.56 38.19,51.56 arc45 38.62,51.74 | 38.62,51.74 R1.1 | 37.27,51.56 arc-90 37.88,50.95 | R2.1 37.88,50.75 arc-45 38.06,51.18 38.62,51.74
N$7
  Top 0.61: CS1.10 29.84,55.02 arc90 29.23,55.63 25.8,55.63 arc45 C2.1
N$8
  Top 0.61: CS1.11 31.11,56.29 arc90 30.5,56.9 23.26,56.9 arc45 C3.1
N$9
  Top 0.203: XBEE.20 23.81,4.88 arc-90 24.01,5.08 R10.2
N$10
  Top 0.203: R10.1 28.06,6.89 arc-45 28.2,6.95 XLED1.AN
N$11
  Top 0.508: R17.2 LED1.AN
N$12
  Top 0.508: R18.2 LED2.AN
N$13
  Top 0.508: R19.2 LED3.AN
N$15
  Top 0.254: PIC1.19 24.34,46.48 arc-90 24.59,46.74 26,46.74 arc90 26.25,46.99 C38.1
  Top 0.762: C38.1 L1.2
N$16
  Top 0.203: PIC1.56 21.34,29.58 arc90 21.54,29.37 C15.+
N$17
  Top 0.508: R31.2 LED4.AN
N$18
  Top 0.61: J11.2 80.82,4.58 arc45 80.39,4.4 R24.2
N$19
  Top 0.61: J10.2 61.42,5.58 arc45 61.85,5.76 R25.2
N$24
  Top 0.305: C21.2 4.53,51.73 arc-45 4.74,51.82 IMU1.10
N$25
  Top 0.203: IMU1.20 11.81,51.32 arc-90 12.01,51.12 12.01,48.51 arc-45 11.96,48.37 C23.1
N$26  (via drill 0.6)
  Top 0.508: v133.6,43.05 133.31,43.05 arc45 132.95,42.9 132.36,42.31 arc-45 132,42.16 126.45,42.16 arc45 126.09,42.02 124.86,40.79 arc-45 124.5,40.64 MD1.24 | v142.62,46.86 142.62,54.57 arc-90 R34.1
  Bottom 0.508: v133.6,43.05 140.46,43.05 arc90 140.97,43.56 140.97,46.35 arc-90 141.48,46.86 v142.62,46.86
N$27
  Top 0.203: R11.1 29.4,17.12 arc-45 29.54,17.18 XLED2.AN
N$30  (via drill 0.6)
  Top 0.203: v17.78,6.35 R12.2 | XBEE.15 13.81,6.11 arc-45 13.87,6.25 v13.97,6.35
  Bottom 0.203: v13.97,6.35 v17.78,6.35
N$31
  Top 0.203: R12.1 22.98,8.16 arc-45 23.12,8.22 XLED3.AN
N$32  (via drill 0.6)
  Top 0.203: R13.2 v12.7,17.78
  Bottom 0.203: v12.7,17.78 12.7,22.51 arc-45 12.76,22.65 XBEE.6
N$35  (via drill 0.6)
  Top 0.508: MD1.22 124.71,38.1 arc90 125.22,38.61 125.22,39.67 arc-45 125.37,40.03 126.47,41.13 arc-45 126.83,41.27 133.14,41.27 arc45 133.5,41.42 v133.6,41.53
  Bottom 0.508: R35.1 132.61,45.83 arc45 132.46,45.47 132.46,42.04 arc90 132.97,41.53 v133.6,41.53
N$36  (via drill 0.6)
  Top 0.508: v127.25,36.7 arc45 126.57,36.83 MD1.21 | v133.1,30.1 132.48,29.49 arc-45 132.12,29.34 128.86,29.34 arc-45 128.5,29.49 v127.25,30.73
  Bottom 0.508: R36.1 133.13,30.06 arc90 v133.1,30.1 | v127.25,30.73 arc90 127.51,30.99 127.51,36.45 arc90 v127.25,36.7
N$37  (via drill 0.6)
  Top 0.508: MD1.19 121.16,34.29 arc90 120.65,33.78 120.65,12.95 arc90 121.16,12.45 v129.41,12.45
  Bottom 0.508: v129.41,12.45 130.98,12.45 arc90 R37.1
N$38  (via drill 0.6)
  Top 0.508: MD1.17 124.38,31.75 arc-45 124.74,31.6 129.14,27.2 arc45 129.5,27.05 v133.22,27.05 | R38.1 142.66,29.12 arc-90 v142.62,29.08
  Bottom 0.508: v133.22,27.05 140.38,27.05 arc45 140.74,27.2 v142.62,29.08
N$39
  Top 0.203: R13.1 27.86,17.78 arc45 28,17.84 XLED4.AN
N$48  (via drill 0.6)
  Top 0.508: MD1.14 122.05,27.94 arc90 121.54,27.43 121.54,14.35 arc90 122.05,13.84 130.47,13.84 arc-45 130.83,13.69 v133.35,11.18 | R39.1 142.66,11.39 arc90 v142.75,11.3
  Bottom 0.508: v142.75,11.3 arc-90 142.62,11.18 v133.35,11.18
N$50
  Top 0.508: R40.1 131.86,22.44 arc-45 131.5,22.59 C17.2 125.6,22.64 arc-90 125.09,23.15 125.09,26.16 arc90 124.59,26.67 MD1.13
N$52  (via drill 0.6)
  Top 0.508: C18.2 arc-90 131.1,39.24 | 133.52,35.94 R41.1 133.96,36.39 arc45 134.11,36.75 134.11,39.37 arc90 133.6,39.88 131.95,39.88 arc45 131.59,39.73 C18.2 | MD1.16 124.25,30.48 arc-45 124.61,30.33 126.98,27.96 arc-45 127.13,27.6 v127.13,27.43 | v127,38.99 130.72,38.99 arc-45 C18.2
  Bottom 0.508: v127,38.99 126.13,38.12 arc45 125.98,37.76 125.98,33.99 arc45 126.13,33.63 126.47,33.3 arc-45 126.62,32.94 126.62,32.09 arc-45 126.47,31.73 126.13,31.39 arc45 125.98,31.03 125.98,29.17 arc45 126.13,28.81 126.98,27.96 arc-45 127.13,27.6 v127.13,27.43
N$54
  Top 0.203: 131.44,45.31 C19.1
  Top 0.508: R43.1 132.76,46.19 arc-45 132.4,46.04 132.27,46.04 arc45 132.1,45.97 131.44,45.31 126.17,45.31 arc45 125.81,45.16 123.72,43.08 arc-45 123.36,42.93 114.57,42.93 arc90 114.06,42.42 MD1.1
N$55
  Top 0.508: R43.2 131.91,48.48 arc90 D3.C
N$57
  Top 0.508: M1.D 121.87,3.71 arc45 122.23,3.56 D8.A 147.76,4.64 arc-45 147.94,4.71 J14.2
N$58
  Top 0.762: D2.C 132.56,33.89 arc-45 133.01,34.08 R41.2
N$59
  Top 0.508: D1.C 132.72,19.68 arc45 133.08,19.83 R40.2
N$60
  Bottom 1.016: D5.C D4.A
N$61
  Bottom 1.016: D10.C D9.A
N$62
  Bottom 1.016: D11.C D12.A
PGEC1
  Top 0.203: PIC1.17 36.73,45.07 arc45 36.87,45.13 PROG.5
PGED1
  Top 0.203: PIC1.18 24.84,44.3 arc90 25.25,43.89 36.67,43.89 arc-45 36.81,43.83 PROG.4
PWM1H  (1 unrouted)
  Top 0.203: PIC1.61 23.84,31.9 arc90 24.04,31.7 42.7,31.7 arc90 42.9,31.9 42.9,46.17 arc-90 43.1,46.37 J3.1
  Top 0.508: DI1.2 100.54,36.2 arc-45 100.18,36.34 100,36.53 arc-45 99.85,36.89 99.85,38.09 arc45 99.7,38.45 99.55,38.6 arc45 99.19,38.75 J12.8
PWM1HO
  Top 0.508: DI1.15 107.94,36.2 arc45 108.3,36.34 111.18,39.22 arc-45 111.54,39.37 MD1.2
PWM1L  (1 unrouted)
  Top 0.203: PIC1.60 23.34,31.81 arc45 23.4,31.67 23.71,31.35 arc45 23.86,31.29 43.1,31.29 arc90 43.31,31.5 43.31,44.17 arc-90 43.51,44.37 J3.2
  Top 0.508: DI1.3 100.46,34.92 arc-45 100.1,35.07 J12.7
PWM1LO
  Top 0.508: DI1.14 107.89,34.92 arc45 108.25,35.07 111.13,37.95 arc-45 111.49,38.1 MD1.3
PWM2H  (via drill 0.6)  (1 unrouted)
  Top 0.203: PIC1.63 24.84,32.72 arc90 25.04,32.51 39.74,32.51 arc45 39.89,32.57 v41.86,34.54
  Top 0.508: DI1.5 99,32.38 arc-45 98.64,32.53 J12.5
  Bottom 0.203: v41.86,34.54 40.62,35.78 arc-45 40.56,35.92 40.56,40.17 arc-90 40.77,40.37 J3.4
PWM2HO
  Top 0.508: MD1.5 111.33,35.56 arc45 110.98,35.41 108.1,32.53 arc-45 107.74,32.38 DI1.12
PWM2L  (via drill 0.6)  (1 unrouted)
  Top 0.203: PIC1.62 24.34,32.31 arc90 24.54,32.11 41.68,32.11 arc90 41.88,32.31 v41.88,32.92
  Top 0.508: DI1.4 99.73,33.66 arc-45 99.37,33.8 J12.6
  Bottom 0.203: J3.3 40.36,42.37 arc90 40.16,42.17 40.16,34.73 arc45 40.22,34.59 v41.88,32.92
PWM2LO
  Top 0.508: DI1.13 107.84,33.66 arc45 108.2,33.8 111.08,36.68 arc-45 111.44,36.83 MD1.4
PWM3H  (via drill 0.6)  (1 unrouted)
  Top 0.203: v41.58,36.98 40.26,36.98 arc90 40.06,36.78 40.06,35.24 arc-45 40,35.09 38.29,33.38 arc-45 38.14,33.33 35.47,33.33 arc-45 35.32,33.38 34.63,34.08 arc45 34.48,34.14 27.49,34.14 arc-90 27.29,34.34 PIC1.1
  Top 0.508: DI1.7 99.73,29.84 arc45 99.37,29.7 J12.3
  Bottom 0.203: J3.6 42.17,36.37 arc-45 42.03,36.43 v41.58,36.98
PWM3HO
  Top 0.508: DI1.10 107.7,29.84 arc-90 108.33,29.21 108.33,27.3 arc90 108.97,26.67 MD1.12
PWM3L  (via drill 0.6)  (1 unrouted)
  Top 0.203: PIC1.64 34.34,33.67 arc-45 34.49,33.61 35.12,32.98 arc45 35.26,32.92 38.55,32.92 arc45 38.69,32.98 41.42,35.7 arc-45 41.56,35.76 42.29,35.76 arc90 42.49,35.97 42.49,37.71 arc45 42.44,37.85 v41.58,38.81
  Top 0.508: DI1.6 99,31.11 arc45 98.64,30.97 J12.4
  Bottom 0.203: J3.5 42.1,38.37 arc-45 41.96,38.43 v41.58,38.81
PWM3LO
  Top 0.508: DI1.11 108.71,31.11 arc-90 109.35,30.48 109.35,28.57 arc90 109.98,27.94 MD1.11
RTS
  Top 0.203: XBEE.16 15.81,10.37 arc45 15.75,10.51 4.17,22.09 arc-45 4.12,22.23 4.12,24.99 arc-90 4.32,25.2 16.56,25.2 arc90 16.76,25.4 16.76,28.75 arc-45 16.82,28.89 18.28,30.35 arc45 18.34,30.49 PIC1.50
RX  (via drill 0.6)
  Top 0.203: v20.83,27.43 20.83,33.66 arc-90 PIC1.55
  Bottom 0.203: v20.83,27.43 21.75,26.51 arc-45 21.81,26.37 XBEE.2
SCL1
  Top 0.203: IMU1.23 12.42,52.82 arc-90 12.62,52.62 12.62,45.6 arc-45 12.56,45.46 12.07,44.97 arc45 12.01,44.82 12.01,43.57 arc45 12.07,43.42 14.32,41.18 arc45 14.46,41.12 PIC1.37
SCL2
  Top 0.203: 14.11,69.28 arc90 13.91,69.48 | 14.31,69.48 arc90 14.11,69.28 | 14.31,69.48 J1.1 | 14.11,69.28 14.11,68.02 arc90 R77.1 | 14.31,69.48 16.31,69.48 arc-90 16.51,69.28 16.51,57.23 arc45 16.57,57.09 17.78,55.88 arc-45 17.84,55.74 PIC1.32
SDA1
  Top 0.203: IMU1.24 12.83,53.32 arc-90 13.03,53.12 13.03,45.4 arc-45 12.97,45.25 12.48,44.76 arc45 12.42,44.62 12.42,43.77 arc45 12.48,43.63 14.43,41.68 arc45 14.57,41.62 PIC1.36
SDA2
  Top 0.203: PIC1.31 18.34,70.28 arc90 18.14,70.48 14.39,70.48 | 14.39,70.48 13.98,70.48 | J1.2 8.56,70.54 arc45 8.7,70.48 13.98,70.48 | 13.98,70.48 arc90 14.19,70.69 | 14.19,70.69 R78.1 | 14.39,70.48 arc-90 14.19,70.69
TOP_MAG  (1 unrouted)
  Top 0.203: 42.39,30.48 arc90 41.99,30.89 23.55,30.89 arc-45 23.41,30.95 22.4,31.96 arc-45 22.34,32.1 PIC1.58
  Top 0.254: 42.39,30.48 42.39,28.29 arc90 42.65,28.04 J4.1
  Top 0.508: DI2.2 99.29,7.62 arc-45 J13.3
TOP_MAGA
  Top 0.203: PIC1.33 15.89,43.59 arc45 15.83,43.73 13.9,45.66 arc-45 13.84,45.8 13.84,63.03 arc90 13.64,63.23 J2.3
TOP_MAGB
  Top 0.203: J2.1 13.23,59.23 arc-90 13.44,59.03 13.44,45.6 arc45 13.5,45.46 14.6,44.36 arc-45 14.66,44.21 14.66,42.82 arc90 14.86,42.62 PIC1.34
TOP_MAGO
  Top 0.508: DI2.6 117.72,6.35 arc-45 118.08,6.2 M1.G
TX  (via drill 0.6)
  Top 0.203: v19.3,27.43 20.28,28.66 arc45 20.34,28.81 PIC1.54
  Bottom 0.203: v19.3,27.43 19.75,26.98 arc-45 19.81,26.84 XBEE.3
USER
  Top 0.254: PIC1.42 6.5,38.62 arc-45 6.32,38.69 USER1.2 4.3,39.15 arc45 4.23,38.98 R42.2

## Text on the board
tPlace: bandwidth | and reduce | limit noise | Install CF to | 1k | Input | SDA | GND | Motor | SCL | I2C | 24V | Capacitors | GND | 24V | 1k | Power | - | - | + | Output | GND | 24V | 1H | A | Current Sense | ACS716 | GND | + | 10uF | .1uF | RESET | B | GND | 24V | CF | MOTOR- | 1nF | 22uF | IFX21004 | 10nF | MPU | 10 | 9150 | .1uF | 22nF | 330k | 1k | 22uF | .1uF | .1uF | L1 | 2.2k | .01uF | ES | 1B | 0 | .1uF | 2.2nF | 1H | 2H | 1L | 100nF | .1uF | 2L | .1uF | HIP4086 | USER | .01uF | .1uF | 10uF | .03uF | 2H | 1 | 1H | .01uF | 3H | 1L | 2.2k | 3L | 1H | 1H | 2L | .03uF | 2 | 1L | 1L | 2H | 10 | GND | 0 | 1 | 2 | 3 | 4 | Motor Control | 2L | 2L | ES | 3.3V | 2H | 2H | 1B | 3 | 3L | 3L | 10k | .1uF | .01uF | CC10-2405SF-E | 3H | SI8660 | EC-B-IS1 | 3H | 10uF | Mag | - | 3H | SI8660 | 3L | EC-B-IS1 | 3H | GND | Motor Control | 10uF | 5V | Magnet | .1uF | 1k | .1uF | .03uF | 0 | .1uF | ES | 1 | GND | 5V | 2 | Secondary | 1B | 1k | 3 | Primary | 10 | 1k | - | 1k | + | GND | 5V | 1117 | 5V | GND | 1k | 10uF | .1uF | + | 2 LED | 1 LED | Mag | 1k | .1uF | 24V | + | - | GND | 1k | - | GND2 | + | SI8410 | ES | 1B | GND | 10uF | GND | Magnet | 5V | BB-D-IS | 5V | SOT | - | 23F
bPlace: ES | ES | 1B | 1B | 20k | 10 | 1L | ES | ES | 1B | 1B | 20k | 2L | 10 | ES | ES | 1B | 1B | 20k | 10 | 3L